# EAGLE schematic DSLR_controller (EAGLE 7.0.0)
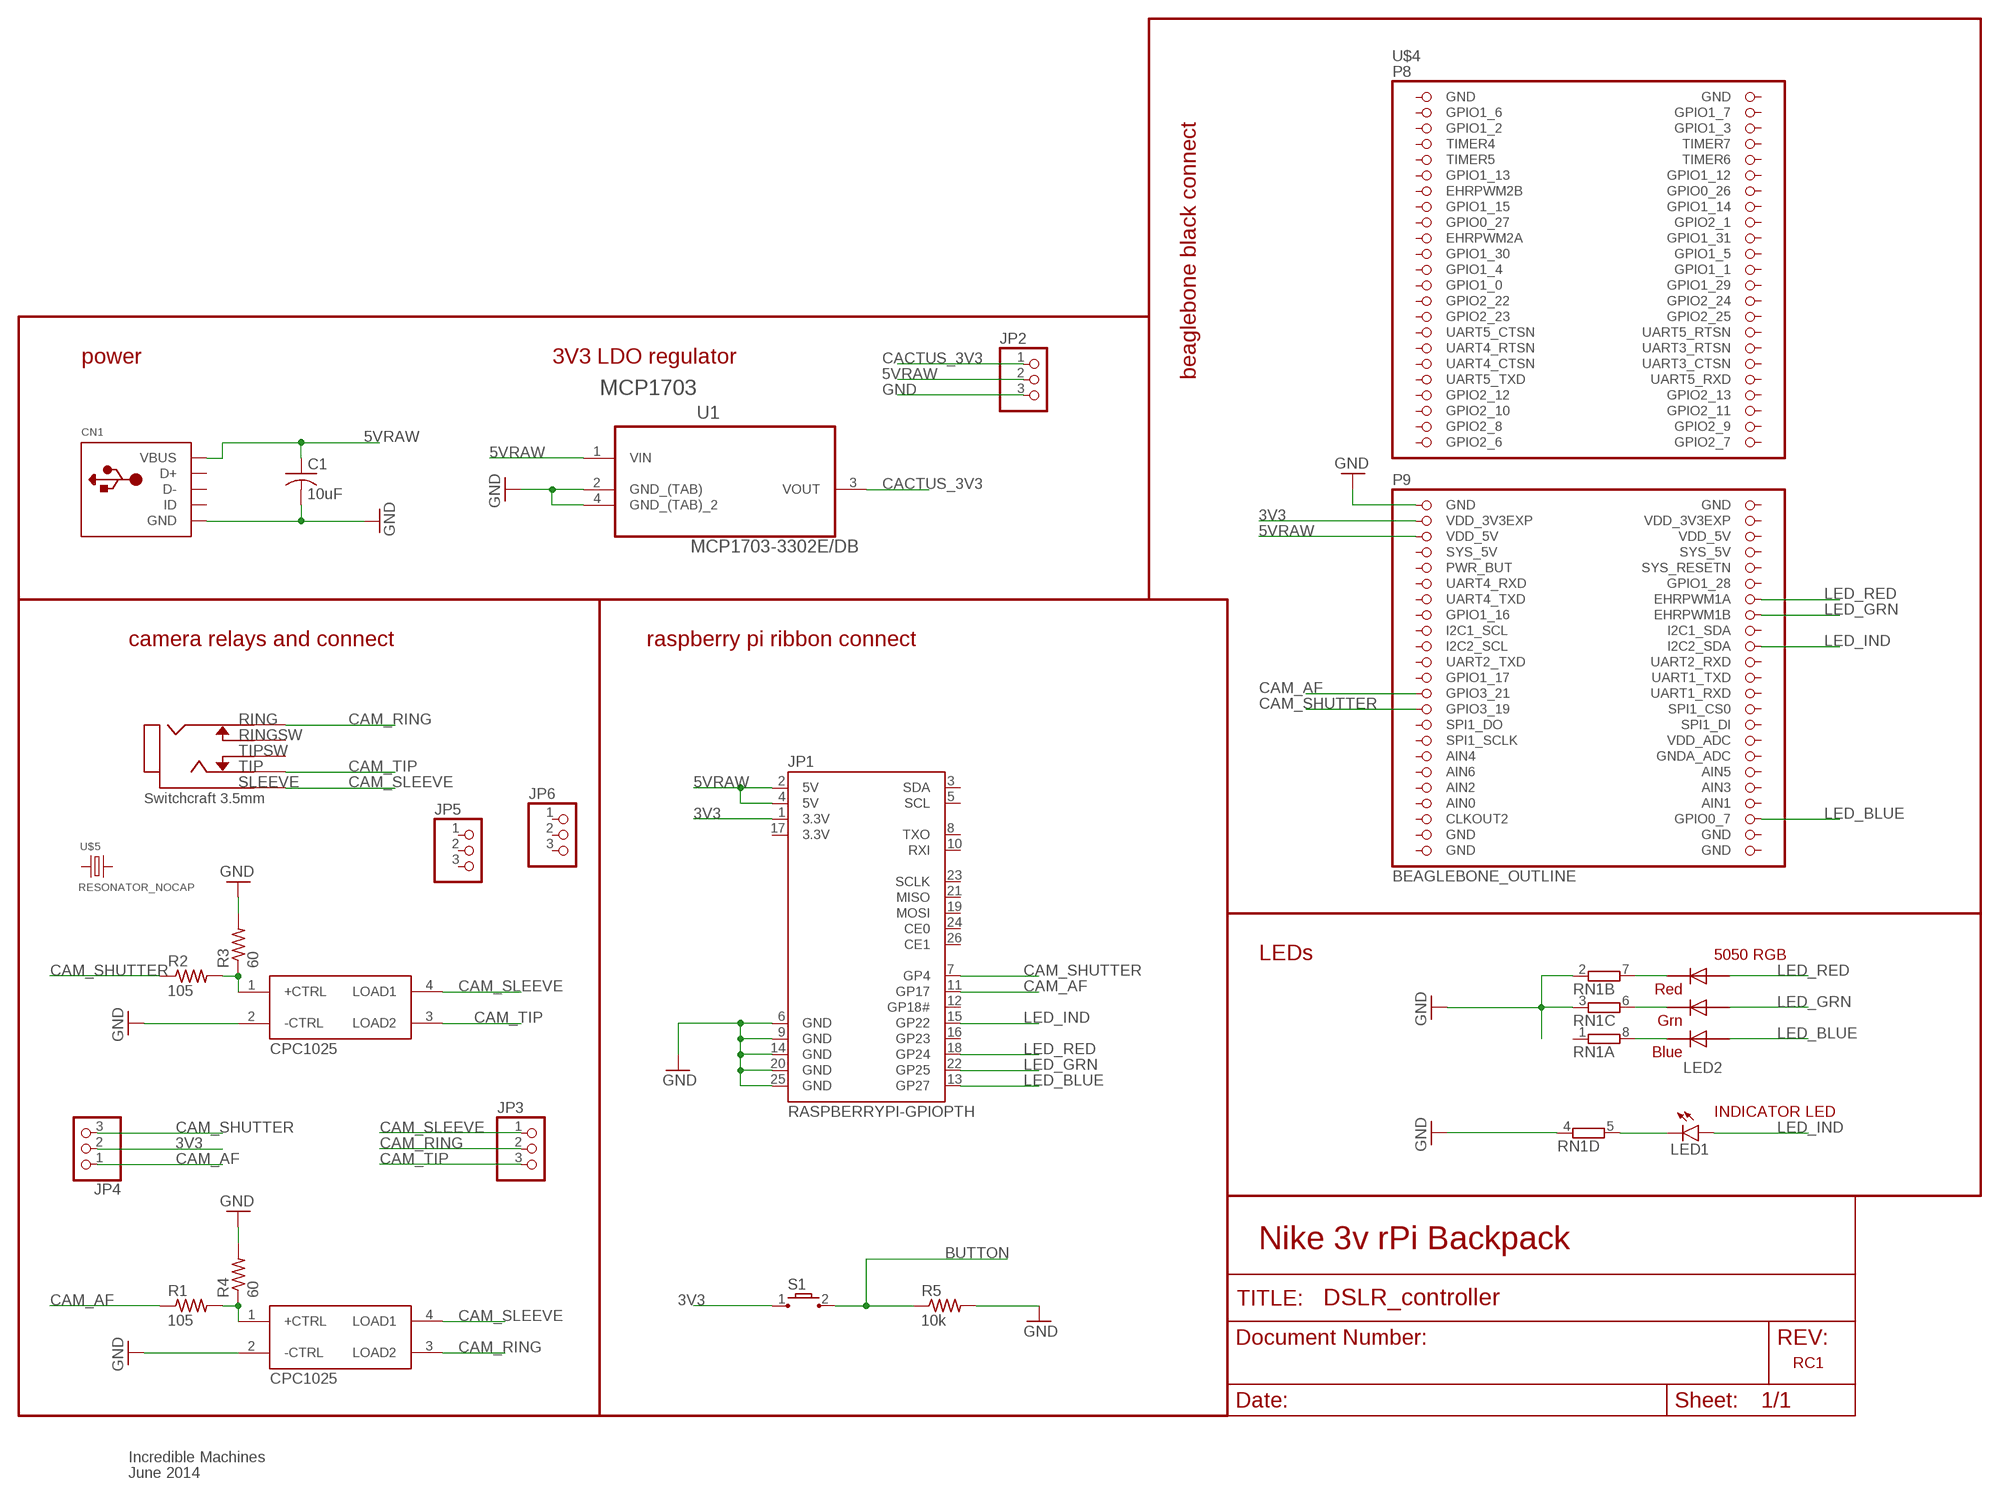
[diagram p0: schematic, sheet 1]

## Parts
C1  10uF  C-USC1206K  [C1206K]
CN1  USBMOLEX  [USB-MINIB-THM-MOLEX]
JP1  RASPBERRYPI-GPIOPTH  [2X13-SHROUDED]
JP2  PINHD-1X3  [1X03]
JP3  PINHD-1X3CB  [1X03-CLEANBIG]
JP4  PINHD-1X3CB  [1X03-CLEANBIG]
JP5  PINHD-1X3CB  [1X03-CLEANBIG]
JP6  PINHD-1X3CB  [1X03-CLEANBIG]
LED1  LED1206  [LED-1206]
LED2  RGBLED5050  [RGBLED5050]
R1  105  R-US_R1206  [R1206]
R2  105  R-US_R1206  [R1206]
R3  60  R-US_R1206  [R1206]
R4  60  R-US_R1206  [R1206]
R5  10k  R-US_R1206  [R1206]
RN1  4R-NEXBS8V  [EXBS8V]
S1  TL3302-G  [TL3302_GULL_WING]
U1  MCP1703-3302E/DB  [SOT230P700X180-4N]
U$1  SWTCHCRFT_3.5JACK5-JACK-SMD  [4-JACK-SMD]
U$2  CPC1025_OPTORELAY  [4-OPTORELAY]
U$3  CPC1025_OPTORELAY  [4-OPTORELAY]
U$4  BEAGLEBONE_OUTLINE  [BEAGLEBONE_SHIELD]
U$5  RESONATOR_NOCAP  [RESONATOR_NOCAP]

## Nets
3V3: JP1.1(3.3V) JP4.2 S1.1 U$4.49(VDD_3V3EXP)
5VRAW: C1.1 CN1.VBUS JP1.2(5V) JP1.4(5V) JP2.2 U1.1(VIN) U$4.51(VDD_5V)
BUTTON: R5.1 S1.2
CACTUS_3V3: JP2.1 U1.3(VOUT)
CAM_AF: JP1.11(GP17) JP4.1 R1.1 U$4.71(GPIO3_21)
CAM_RING: JP3.2 U$1.2 U$2.3(LOAD2)
CAM_SHUTTER: JP1.7(GP4) JP4.3 R2.1 U$4.73(GPIO3_19)
CAM_SLEEVE: JP3.1 U$1.1 U$2.4(LOAD1) U$3.4(LOAD1)
CAM_TIP: JP3.3 U$1.3 U$3.3(LOAD2)
GND: C1.2 CN1.GND JP1.6(GND) JP1.9(GND) JP1.14(GND) JP1.20(GND) JP1.25(GND) JP2.3 R3.2 R4.2 R5.2 RN1.2 RN1.3 RN1.4 U1.2(GND_(TAB)) U1.4(GND_(TAB)_2) U$2.2(-CTRL) U$3.2(-CTRL) U$4.47(GND)
LED_BLUE: JP1.13(GP27) LED2.3(BLUE_A) U$4.88(GPIO0_7)
LED_GRN: JP1.22(GP25) LED2.1(GREEN_A) U$4.62(EHRPWM1B)
LED_IND: JP1.15(GP22) LED1.A U$4.66(I2C2_SDA)
LED_RED: JP1.18(GP24) LED2.2(RED_A) U$4.60(EHRPWM1A)
N$1: LED2.6(GREEN_C) RN1.6
N$2: LED2.5(RED_C) RN1.7
N$3: LED2.4(BLUE_C) RN1.8
N$4: LED1.C RN1.5
N$6: R1.2 R4.1 U$2.1(+CTRL)
N$7: R2.2 R3.1 U$3.1(+CTRL)
Unconnected: CN1.D+ CN1.D- CN1.ID JP1.3(SDA) JP1.5(SCL) JP1.8(TXO) JP1.10(RXI) JP1.12(GP18#) JP1.16(GP23) JP1.19(MOSI) JP1.21(MISO) JP1.23(SCLK) JP1.24(CE0) JP1.26(CE1) JP5.1 JP5.2 JP5.3 JP6.1 JP6.2 JP6.3 RN1.1 U$1.4 U$1.5 U$4.3(GPIO1_6) U$4.4(GPIO1_7) U$4.5(GPIO1_2) U$4.6(GPIO1_3) U$4.7(TIMER4) U$4.8(TIMER7) U$4.9(TIMER5) U$4.10(TIMER6) U$4.11(GPIO1_13) U$4.12(GPIO1_12) U$4.13(EHRPWM2B) U$4.14(GPIO0_26) U$4.15(GPIO1_15) U$4.16(GPIO1_14) U$4.17(GPIO0_27) U$4.18(GPIO2_1) U$4.19(EHRPWM2A) U$4.20(GPIO1_31) U$4.21(GPIO1_30) U$4.22(GPIO1_5) U$4.23(GPIO1_4) U$4.24(GPIO1_1) U$4.25(GPIO1_0) U$4.26(GPIO1_29) U$4.27(GPIO2_22) U$4.28(GPIO2_24) U$4.29(GPIO2_23) U$4.30(GPIO2_25) U$4.31(UART5_CTSN) U$4.32(UART5_RTSN) U$4.33(UART4_RTSN) U$4.34(UART3_RTSN) U$4.35(UART4_CTSN) U$4.36(UART3_CTSN) U$4.37(UART5_TXD) U$4.38(UART5_RXD) U$4.39(GPIO2_12) U$4.40(GPIO2_13) U$4.41(GPIO2_10) U$4.42(GPIO2_11) U$4.43(GPIO2_8) U$4.44(GPIO2_9) U$4.45(GPIO2_6) U$4.46(GPIO2_7) U$4.54(SYS_5V) U$4.55(PWR_BUT) U$4.56(SYS_RESETN) U$4.57(UART4_RXD) U$4.58(GPIO1_28) U$4.59(UART4_TXD) U$4.61(GPIO1_16) U$4.63(I2C1_SCL) U$4.64(I2C1_SDA) U$4.65(I2C2_SCL) U$4.67(UART2_TXD) U$4.68(UART2_RXD) U$4.69(GPIO1_17) U$4.70(UART1_TXD) U$4.72(UART1_RXD) U$4.74(SPI1_CS0) U$4.75(SPI1_DO) U$4.76(SPI1_DI) U$4.77(SPI1_SCLK) U$4.78(VDD_ADC) U$4.79(AIN4) U$4.80(GNDA_ADC) U$4.81(AIN6) U$4.82(AIN5) U$4.83(AIN2) U$4.84(AIN3) U$4.86(AIN1) U$4.87(CLKOUT2) U$5.P$1 U$5.P$2

## Notes on the sheet
- power | 3V3 LDO regulator
- beaglebone black connect
- MCP1703
- camera relays and connect | raspberry pi ribbon connect
- LEDs | 5050 RGB
- INDICATOR LED
- Nike 3v rPi Backpack
- RC1
- Incredible Machines
- June 2014

## Power pins joined to a net without a drawn wire
3.3V: JP1.17(3.3V)
AIN0: U$4.85(AIN0)
GND: U$4.1(GND) U$4.2(GND) U$4.48(GND) U$4.89(GND) U$4.90(GND) U$4.91(GND) U$4.92(GND)
SYS_5V: U$4.53(SYS_5V)
VDD_3V3EXP: U$4.50(VDD_3V3EXP)
VDD_5V: U$4.52(VDD_5V)

## Library data of the parts
C1 = adafruit:C-US: CAPACITOR, American symbol
CN1 = adafruit:USB: USB Connectors USBMINIB - Surface Mount Female Mini-B USB Connector 4UConnector: 06564 By microbuilder.eu Thru-hole RA Female Mini-B USB Connector 4UConnector: 18732 By ladyada.net
JP1 = SparkFun-Boards:RASPBERRYPI-GPIO: RASPBERRY PI I/O HEADER As defined for the Revistion 2 Pi.; DIST: sparkfun; DIST_ID: PRT-11490
JP2-JP6 = adafruit:PINHD-1X3: PIN HEADER
LED1 = SparkFun-LED:LED: LEDs Standard schematic elements and footprints for 5mm, 3mm, 1206, and 0603 sized LEDs. 5mm - Spark Fun Electronics SKU : COM-00529 (and others)
LED2 = adafruit:RGBLED: For 5050 RGB LEDs, the order of the LEDs may vary from one manufacturer to another!
R1-R5 = adafruit:R-US_: RESISTOR, American symbol
RN1 = resistor-dil:4R-N: Array Chip Resistor Source: RS Component / Phycomp; OC_FARNELL: unknown; OC_NEWARK: unknown
S1 = eswitch-tact:TL3302: E-Switch TL3302 Series Tactile Switch Surface mount button commonly used for reset or general input. 3.5 x 6mm packaged design. -G: Gull wing termination. Parts TL-3302-x-xxxx-x-G -J: J-Lead termination. Parts TL-3302-x-xxxx-x-J Source: http://www.e-switch.com/Portals/0/Series_Pdf/TL3302.pdf Supplier: DigiKey: http://be.digikey.com/scripts/dksearch/dksus.dll?vendor=0&keywords=TL3302
U1 = Microchip_By_element14_Batch_1:MCP1703-3302E/DB: IC REG LDO 3.3V 250MA; MPN: MCP1703-3302E/DB; OC_FARNELL: 1627177; OC_NEWARK: 40M0623; PACKAGE: SOT-223-3; SUPPLIER: Microchip
U$1 = jmsaavedra:SWTCHCRFT_3.5JACK: Switchcraft 3.5mm Stereo Audio Jack manufacturer: 35RASMT4BHNTRX digikey: SC1488-1-ND
U$2 U$3 = jmsaavedra:CPC1025_OPTORELAY: CPC1025N Solid State Relay IXYS part: CPC1025NTR digikey part: CLA234CT-ND http://www.clare.com/home/pdfs.nsf/www/CPC1025N.pdf/$file/CPC1025N.pdf
U$4 = adafruit:BEAGLEBONE_OUTLINE: Should match A3 pinout - but not completely tested
U$5 = SparkFun-FreqCtrl:RESONATOR_NOCAP

## Net classes
1 VCC: width 0.381 mm